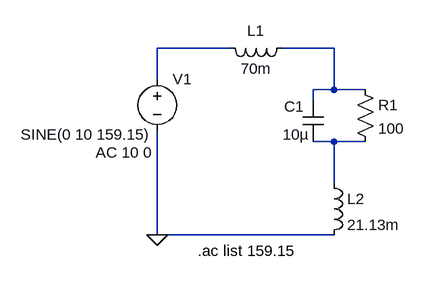
[diagram p0: schematic assignment4_sim.asc]
assignment4_sim.asc, the LTspice schematic file:
Version 4
SHEET 1 880 680
WIRE 16 -32 -96 -32
WIRE 176 -32 96 -32
WIRE -96 16 -96 -32
WIRE 176 32 176 -32
WIRE 176 32 144 32
WIRE 224 32 176 32
WIRE 144 48 144 32
WIRE 176 112 144 112
WIRE 224 112 176 112
WIRE 176 176 176 112
WIRE -96 256 -96 96
WIRE 176 256 -96 256
FLAG -96 256 0
SYMBOL cap 128 48 R0
WINDOW 0 -29 10 Left 2
WINDOW 3 -31 53 Left 2
SYMATTR InstName C1
SYMATTR Value 10µ
SYMBOL res 208 16 R0
SYMATTR InstName R1
SYMATTR Value 100
SYMBOL voltage -96 0 R0
WINDOW 3 -210 101 Left 2
WINDOW 123 -95 129 Left 2
WINDOW 39 0 0 Left 0
SYMATTR InstName V1
SYMATTR Value SINE(0 10 159.15)
SYMATTR Value2 AC 10 0
SYMBOL ind 160 160 R0
SYMATTR InstName L2
SYMATTR Value 21.13m
SYMBOL ind 112 -48 R90
WINDOW 0 5 56 VBottom 2
WINDOW 3 32 56 VTop 2
SYMATTR InstName L1
SYMATTR Value 70m
TEXT -34 280 Left 2 !.ac list 159.15

The netlist it stands for:
* assignment4_sim.asc
C1 N002 N003 10µ
R1 N002 N003 100
V1 N001 0 SINE(0 10 159.15) AC 10 0
L2 N003 0 21.13m
L1 N002 N001 70m
.ac list 159.15
.backanno
.end